# Altium schematic sheet [04] - LCD, VGA.SchDoc: IMXBB
size A3; DocumentNumber: 4; Revision: 2.0; SheetNumber: 4; SheetTotal: 13
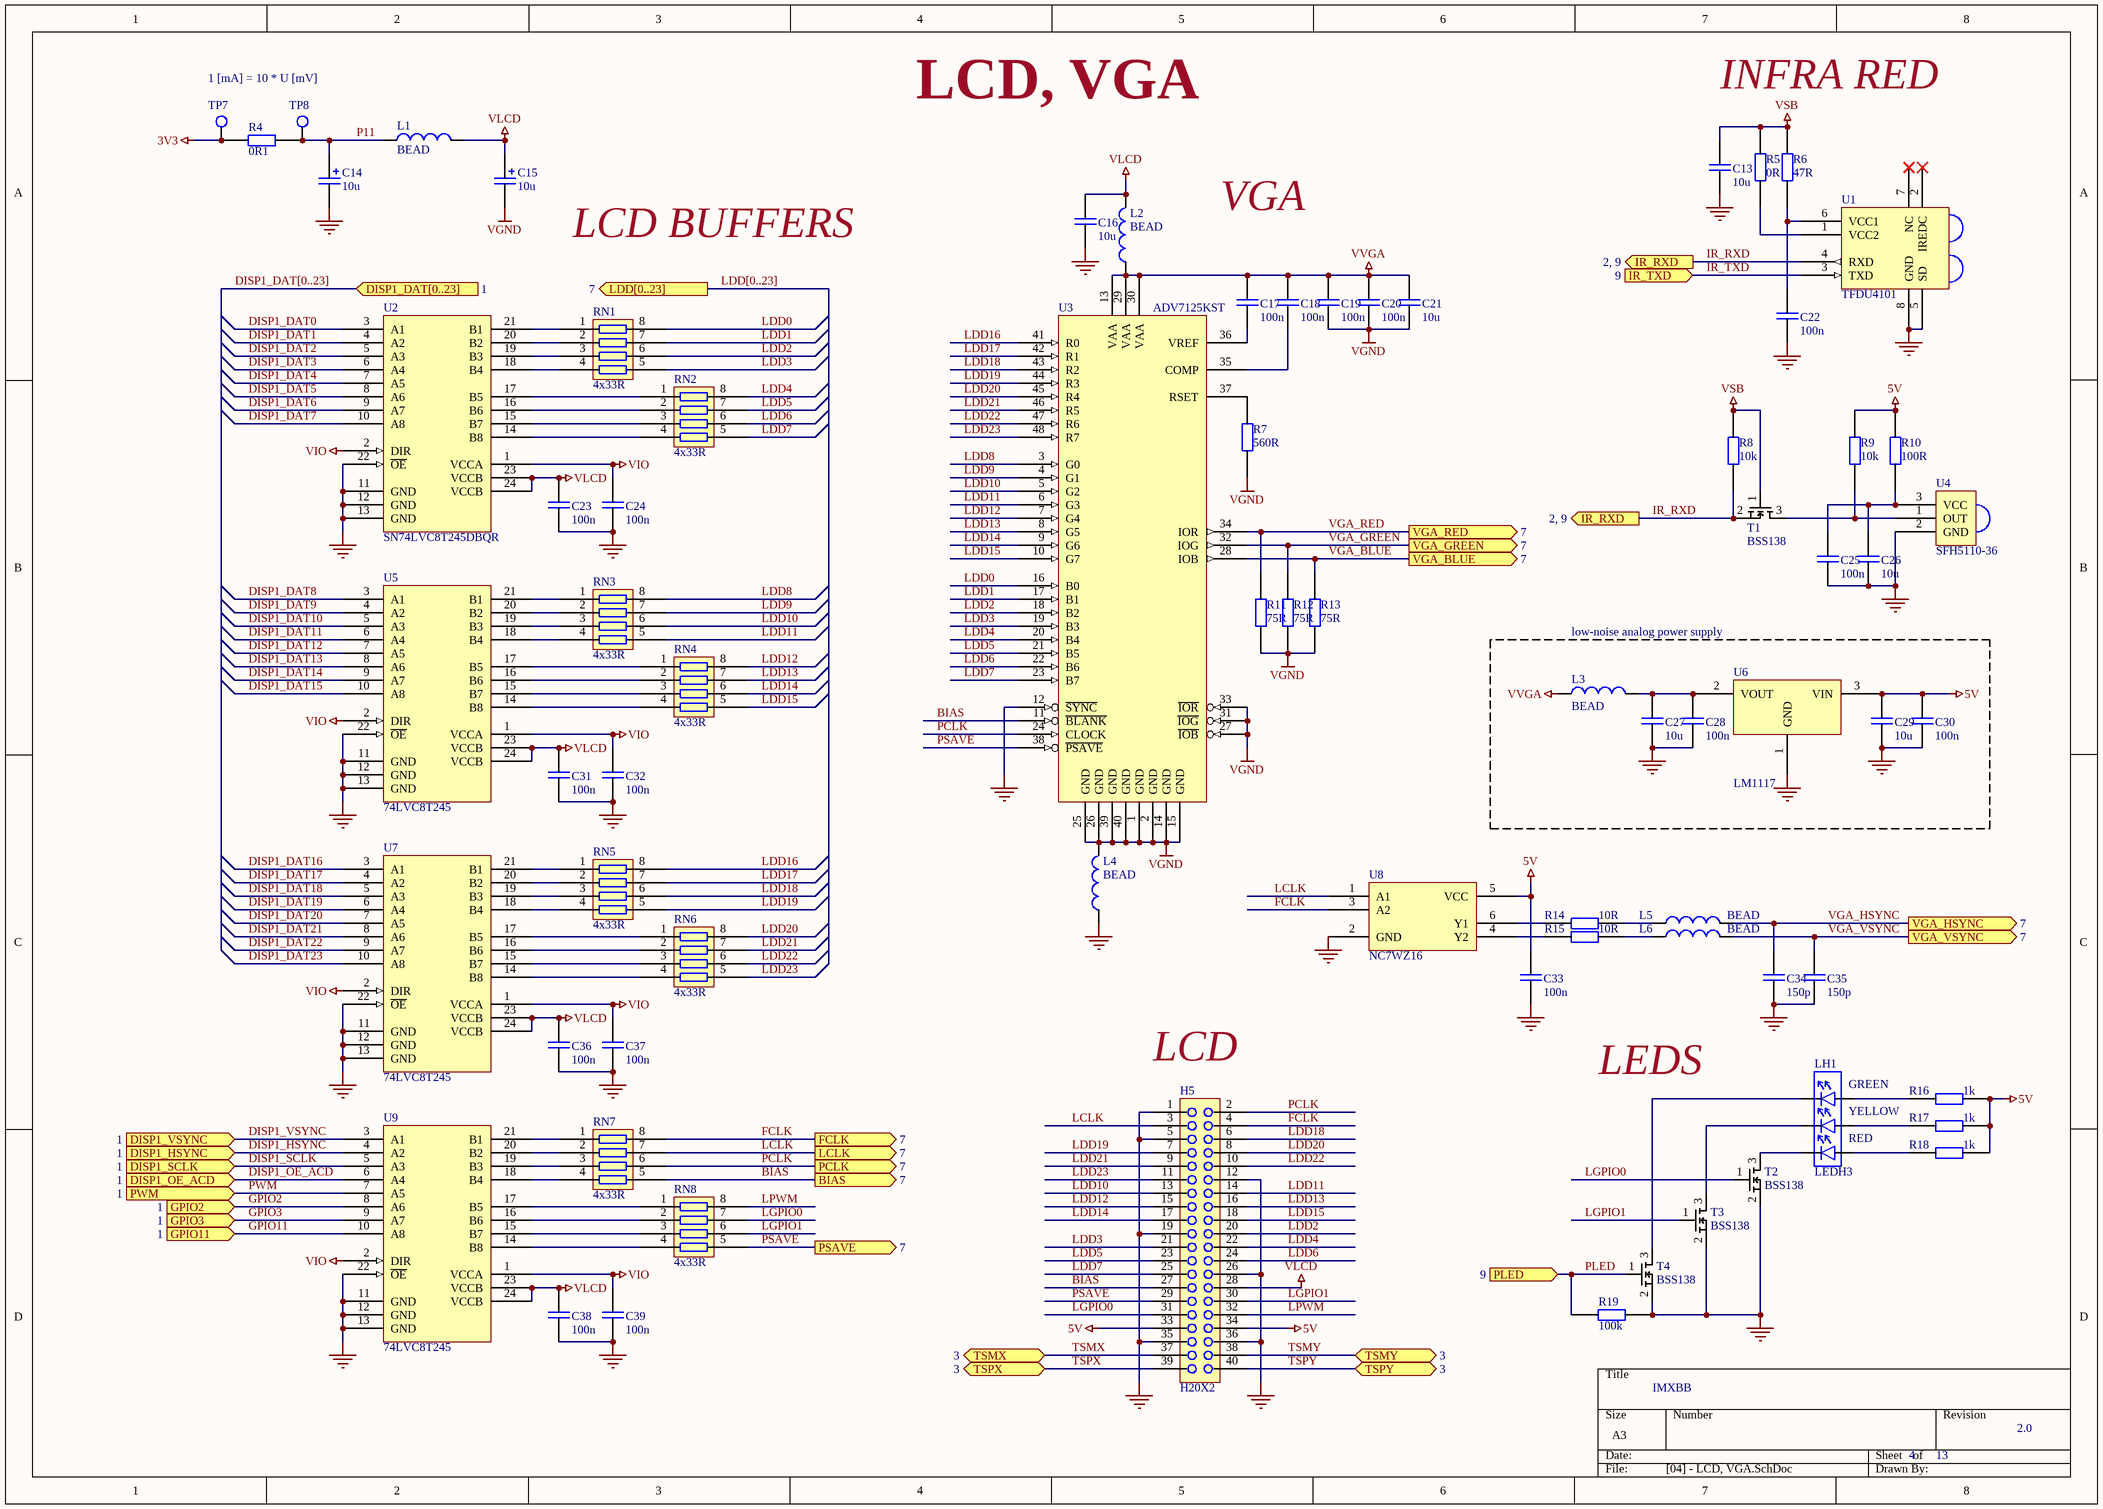
[diagram p0: [04] - LCD, VGA.SchDoc]

## Parts
C13  10u  [0805]
C14  10u  [3216A]
C15  10u  [3216A]
C16  10u  [0805]
C17  100n  [0603]
C18  100n  [0603]
C19  100n  [0603]
C20  100n  [0603]
C21  10u  [0805]
C22  100n  [0603]
C23  100n  [0603]
C24  100n  [0603]
C25  100n  [0603]
C26  10u  [0805]
C27  10u  [0805]
C28  100n  [0603]
C29  10u  [0805]
C30  100n  [0603]
C31  100n  [0603]
C32  100n  [0603]
C33  100n  [0603]
C34  150p  [0603]
C35  150p  [0603]
C36  100n  [0603]
C37  100n  [0603]
C38  100n  [0603]
C39  100n  [0603]
H5  H20X2  [H2x20]
L1  BEAD  [0603]
L2  BEAD  [0603]
L3  BEAD  [0603]
L4  BEAD  [0603]
L5  BEAD  [0603]
L6  BEAD  [0603]
LH1  LEDH3  [LED HOLDER 3]
R4  0R1  [0603]
R5  0R  [0603]
R6  47R  [0603]
R7  560R  [0603]
R8  10k  [0603]
R9  10k  [0603]
R10  100R  [0603]
R11  75R  [0603]
R12  75R  [0603]
R13  75R  [0603]
R14  10R  [0603]
R15  10R  [0603]
R16  1k  [0603]
R17  1k  [0603]
R18  1k  [0603]
R19  100k  [0603]
RN1  4x33R  [RX4_NS]
RN2  4x33R  [RX4_NS]
RN3  4x33R  [RX4_NS]
RN4  4x33R  [RX4_NS]
RN5  4x33R  [RX4_NS]
RN6  4x33R  [RX4_NS]
RN7  4x33R  [RX4_NS]
RN8  4x33R  [RX4_NS]
T1  BSS138  [SOT23]
T2  BSS138  [SOT23]
T3  BSS138  [SOT23]
T4  BSS138  [SOT23]
TP7  TESTPOINT  [TESTPOINT_2mm]  (value not drawn)
TP8  TESTPOINT  [TESTPOINT_2mm]  (value not drawn)
U1  TFDU4101  [TDFU4101]
U2  SN74LVC8T245DBQR
U3  ADV7125KST  [LQFP48]
U4  SFH5110-36  [SFH511x]
U5  74LVC8T245  [TSSOP24]
U6  LM1117  [SOT223]
U7  74LVC8T245  [TSSOP24]
U8  NC7WZ16  [SC70]
U9  74LVC8T245  [TSSOP24]

## Blocks framed on the sheet
low-noise analog power supply: C27-C30 L3 U6

## Ports
BIAS (out, see 7), DISP1_DAT[0..23] (in, see 1), DISP1_HSYNC (in, see 1), DISP1_OE_ACD (in, see 1), DISP1_SCLK (in, see 1), DISP1_VSYNC (in, see 1), FCLK (out, see 7), GPIO2 (in, see 1), GPIO3 (in, see 1), GPIO11 (in, see 1), IR_RXD (out, see 2, 9), IR_TXD (in, see 9), LCLK (out, see 7), LDD[0..23] (out, see 7), PCLK (out, see 7), PLED (in, see 9), PSAVE (out, see 7), PWM (in, see 1), TSMX (see 3), TSMY (see 3), TSPX (see 3), TSPY (see 3), VGA_BLUE (out, see 7), VGA_GREEN (out, see 7), VGA_HSYNC (out, see 7), VGA_RED (out, see 7), VGA_VSYNC (out, see 7)

## Nets
3V3: R4.1 TP7.1
5V: C29.2 C30.2 C33.2 H5.33 H5.34 R9.1 R10.1 R16.1 R17.1 R18.1 U6.3(VIN) U8.5(VCC)
GND: C13.1 C14.2 C16.1 C22.1 C23.1 C24.1 C25.1 C26.1 C27.1 C28.1 C29.1 C30.1 C31.1 C32.1 C33.1 C34.1 C35.1 C36.1 C37.1 C38.1 C39.1 H5.1 H5.5 H5.12 H5.19 H5.26 H5.35 H5.36 L4.1 R19.2 T2.2(S) T3.2(S) T4.2(S) U1.5(SD) U1.8(GND) U2.11(GND) U2.12(GND) U2.13(GND) U2.22(~{OE}) U3.12(~{SYNC}) U4.2(GND) U5.11(GND) U5.12(GND) U5.13(GND) U5.22(~{OE}) U6.1(GND) U7.11(GND) U7.12(GND) U7.13(GND) U7.22(~{OE}) U8.2(GND) U9.11(GND) U9.12(GND) U9.13(GND) U9.22(~{OE})
VGND: C15.2 C19.1 C20.1 C21.1 L4.2 R7.1 R11.1 R12.1 R13.1 U3.1(GND) U3.2(GND) U3.14(GND) U3.15(GND) U3.25(GND) U3.26(GND) U3.27(~{IOB}) U3.31(~{IOG}) U3.33(~{IOR}) U3.39(GND) U3.40(GND)
VIO: C24.2 C32.2 C37.2 C39.2 U2.1(VCCA) U2.2(DIR) U5.1(VCCA) U5.2(DIR) U7.1(VCCA) U7.2(DIR) U9.1(VCCA) U9.2(DIR)
VLCD: C15.1 C16.2 C23.2 C31.2 C36.2 C38.2 H5.28 L1.1 L2.2 U2.23(VCCB) U2.24(VCCB) U5.23(VCCB) U5.24(VCCB) U7.23(VCCB) U7.24(VCCB) U9.23(VCCB) U9.24(VCCB)
VSB: C13.2 R5.2 R6.1 R8.1 T1.1(G)
VVGA: C17.2 C18.2 C19.2 C20.2 C21.2 L2.1 L3.1 U3.13(VAA) U3.29(VAA) U3.30(VAA)
BIAS: H5.27 RN7.5 U3.11(~{BLANK}) ; port BIAS
DISP1_DAT0: U2.3(A1)
DISP1_DAT1: U2.4(A2)
DISP1_DAT2: U2.5(A3)
DISP1_DAT3: U2.6(A4)
DISP1_DAT4: U2.7(A5)
DISP1_DAT5: U2.8(A6)
DISP1_DAT6: U2.9(A7)
DISP1_DAT7: U2.10(A8)
DISP1_DAT8: U5.3(A1)
DISP1_DAT9: U5.4(A2)
DISP1_DAT10: U5.5(A3)
DISP1_DAT11: U5.6(A4)
DISP1_DAT12: U5.7(A5)
DISP1_DAT13: U5.8(A6)
DISP1_DAT14: U5.9(A7)
DISP1_DAT15: U5.10(A8)
DISP1_DAT16: U7.3(A1)
DISP1_DAT17: U7.4(A2)
DISP1_DAT18: U7.5(A3)
DISP1_DAT19: U7.6(A4)
DISP1_DAT20: U7.7(A5)
DISP1_DAT21: U7.8(A6)
DISP1_DAT22: U7.9(A7)
DISP1_DAT23: U7.10(A8)
DISP1_HSYNC: U9.4(A2) ; port DISP1_HSYNC
DISP1_OE_ACD: U9.6(A4) ; port DISP1_OE_ACD
DISP1_SCLK: U9.5(A3) ; port DISP1_SCLK
DISP1_VSYNC: U9.3(A1) ; port DISP1_VSYNC
FCLK: H5.4 RN7.8 U8.3(A2) ; port FCLK
GPIO2: U9.8(A6) ; port GPIO2
GPIO3: U9.9(A7) ; port GPIO3
GPIO11: U9.10(A8) ; port GPIO11
IR_RXD: R8.2 T1.2(S) U1.4(RXD) ; port IR_RXD
IR_TXD: U1.3(TXD) ; port IR_TXD
LCLK: H5.3 RN7.7 U8.1(A1) ; port LCLK
LDD0: RN1.8 U3.16(B0)
LDD1: RN1.7 U3.17(B1)
LDD2: H5.20 RN1.6 U3.18(B2)
LDD3: H5.21 RN1.5 U3.19(B3)
LDD4: H5.22 RN2.8 U3.20(B4)
LDD5: H5.23 RN2.7 U3.21(B5)
LDD6: H5.24 RN2.6 U3.22(B6)
LDD7: H5.25 RN2.5 U3.23(B7)
LDD8: RN3.8 U3.3(G0)
LDD9: RN3.7 U3.4(G1)
LDD10: H5.13 RN3.6 U3.5(G2)
LDD11: H5.14 RN3.5 U3.6(G3)
LDD12: H5.15 RN4.8 U3.7(G4)
LDD13: H5.16 RN4.7 U3.8(G5)
LDD14: H5.17 RN4.6 U3.9(G6)
LDD15: H5.18 RN4.5 U3.10(G7)
LDD16: RN5.8 U3.41(R0)
LDD17: RN5.7 U3.42(R1)
LDD18: H5.6 RN5.6 U3.43(R2)
LDD19: H5.7 RN5.5 U3.44(R3)
LDD20: H5.8 RN6.8 U3.45(R4)
LDD21: H5.9 RN6.7 U3.46(R5)
LDD22: H5.10 RN6.6 U3.47(R6)
LDD23: H5.11 RN6.5 U3.48(R7)
LGPIO0: H5.31 RN8.7 T2.1(G)
LGPIO1: H5.30 RN8.6 T3.1(G)
LPWM: H5.32 RN8.8
P11: C14.1 L1.2 R4.2 TP8.1
PCLK: H5.2 RN7.6 U3.24(CLOCK) ; port PCLK
PLED: R19.1 T4.1(G) ; port PLED
PSAVE: H5.29 RN8.5 U3.38(~{PSAVE}) ; port PSAVE
PWM: U9.7(A5) ; port PWM
TSMX: H5.37 ; port TSMX
TSMY: H5.38 ; port TSMY
TSPX: H5.39 ; port TSPX
TSPY: H5.40 ; port TSPY
VGA_BLUE: R13.2 U3.28(IOB) ; port VGA_BLUE
VGA_GREEN: R12.2 U3.32(IOG) ; port VGA_GREEN
VGA_HSYNC: C34.2 L5.2 ; port VGA_HSYNC
VGA_RED: R11.2 U3.34(IOR) ; port VGA_RED
VGA_VSYNC: C35.2 L6.2 ; port VGA_VSYNC
NetC17_1: C17.1 U3.36(VREF)
NetC18_1: C18.1 U3.35(COMP)
NetC22_2: C22.2 R6.2 U1.6(VCC1)
NetC25_2: C25.2 C26.2 R10.2 U4.3(VCC)
NetC27_2: C27.2 C28.2 L3.2 U6.2(VOUT)
NetL5_1: L5.1 R14.1
NetL6_1: L6.1 R15.1
NetLH1_1: LH1.1 T4.3(D)
NetLH1_2: LH1.2 R16.2
NetLH1_3: LH1.3 T3.3(D)
NetLH1_4: LH1.4 R17.2
NetLH1_5: LH1.5 T2.3(D)
NetLH1_6: LH1.6 R18.2
NetR5_1: R5.1 U1.1(VCC2)
NetR7_2: R7.2 U3.37(RSET)
NetR9_2: R9.2 T1.3(D) U4.1(OUT)
NetR14_2: R14.2 U8.6(Y1)
NetR15_2: R15.2 U8.4(Y2)
NetRN1_1: RN1.1 U2.21(B1)
NetRN1_2: RN1.2 U2.20(B2)
NetRN1_3: RN1.3 U2.19(B3)
NetRN1_4: RN1.4 U2.18(B4)
NetRN2_1: RN2.1 U2.17(B5)
NetRN2_2: RN2.2 U2.16(B6)
NetRN2_3: RN2.3 U2.15(B7)
NetRN2_4: RN2.4 U2.14(B8)
NetRN3_1: RN3.1 U5.21(B1)
NetRN3_2: RN3.2 U5.20(B2)
NetRN3_3: RN3.3 U5.19(B3)
NetRN3_4: RN3.4 U5.18(B4)
NetRN4_1: RN4.1 U5.17(B5)
NetRN4_2: RN4.2 U5.16(B6)
NetRN4_3: RN4.3 U5.15(B7)
NetRN4_4: RN4.4 U5.14(B8)
NetRN5_1: RN5.1 U7.21(B1)
NetRN5_2: RN5.2 U7.20(B2)
NetRN5_3: RN5.3 U7.19(B3)
NetRN5_4: RN5.4 U7.18(B4)
NetRN6_1: RN6.1 U7.17(B5)
NetRN6_2: RN6.2 U7.16(B6)
NetRN6_3: RN6.3 U7.15(B7)
NetRN6_4: RN6.4 U7.14(B8)
NetRN7_1: RN7.1 U9.21(B1)
NetRN7_2: RN7.2 U9.20(B2)
NetRN7_3: RN7.3 U9.19(B3)
NetRN7_4: RN7.4 U9.18(B4)
NetRN8_1: RN8.1 U9.17(B5)
NetRN8_2: RN8.2 U9.16(B6)
NetRN8_3: RN8.3 U9.15(B7)
NetRN8_4: RN8.4 U9.14(B8)

Not connected (* = marked no-connect by the designer): U1 2(IREDC)* 7(NC)*

## Buses and harness runs
bus DISP1_DAT[0..23] = port DISP1_DAT[0..23]
bus LDD[0..23] = port LDD[0..23]

## Notes on the sheet
- 1 [mA] = 10 * U [mV]
- LCD, VGA
- INFRA RED
- LCD BUFFERS
- VGA
- (near H5) LCD
- LEDS
- (in symbol LEDH3) GREEN; YELLOW; RED

## Library data of the parts
C13 C16-C39 = C
C14 C15 = C+
L1-L6 = FBEAD
R4-R19 = R
RN1-RN8 = RN4
TP7 TP8 = TESTPOINT: Testpoint pad; Order number: no component; Component class: TP; Producer: n/a; Assembly type: no component
U2 = SN74LVC8T245DBQR: IC BUS TRANSCVR 8BIT 24QSOP; Manufacturer: Texas Instruments; Logic Function: Translator, Bidirectional, 3-State; Number of Bits: 8; Input Type: Logic; Number of Channels: 1; Differential - Input:Output: No/No; Propagation Delay (Max): 4.2ns; Voltage - Supply: 1.65 V ~ 5.5 V; Supplier 1: Digi-Key; Manufacturer Part Number: SN74LVC8T245DBQR; RoHS: RoHS Compliant; Category: Integrated Circuits (ICs); Stock 1: 4942; Pricing 1: 1=1.26, 10=1.117, 25=1.008, 100=0.4725, 250=0.46376, 500=0.455, 750=0.44625 (USD); Output Type: Logic; Data Rate: -; Number of Outputs/Channel: 8; Operating Temperature: -40°C ~ 85°C; Package / Case: 24-SSOP (0.154", 3.90mm Width); Supplier Device Package: 24-SSOP/QSOP; Packaging: Cut Tape (CT); ComponentLink1URL: http://www.ti.com/lit/ds/symlink/sn74lvc8t245.pdf; ComponentLink1Description: http://www.ti.com/lit/ds/symlink/sn74lvc8t245.pdf; Supplier Part Number 1: 296-23279-1-ND
U3 = ADV7125
U4 = SFH5110